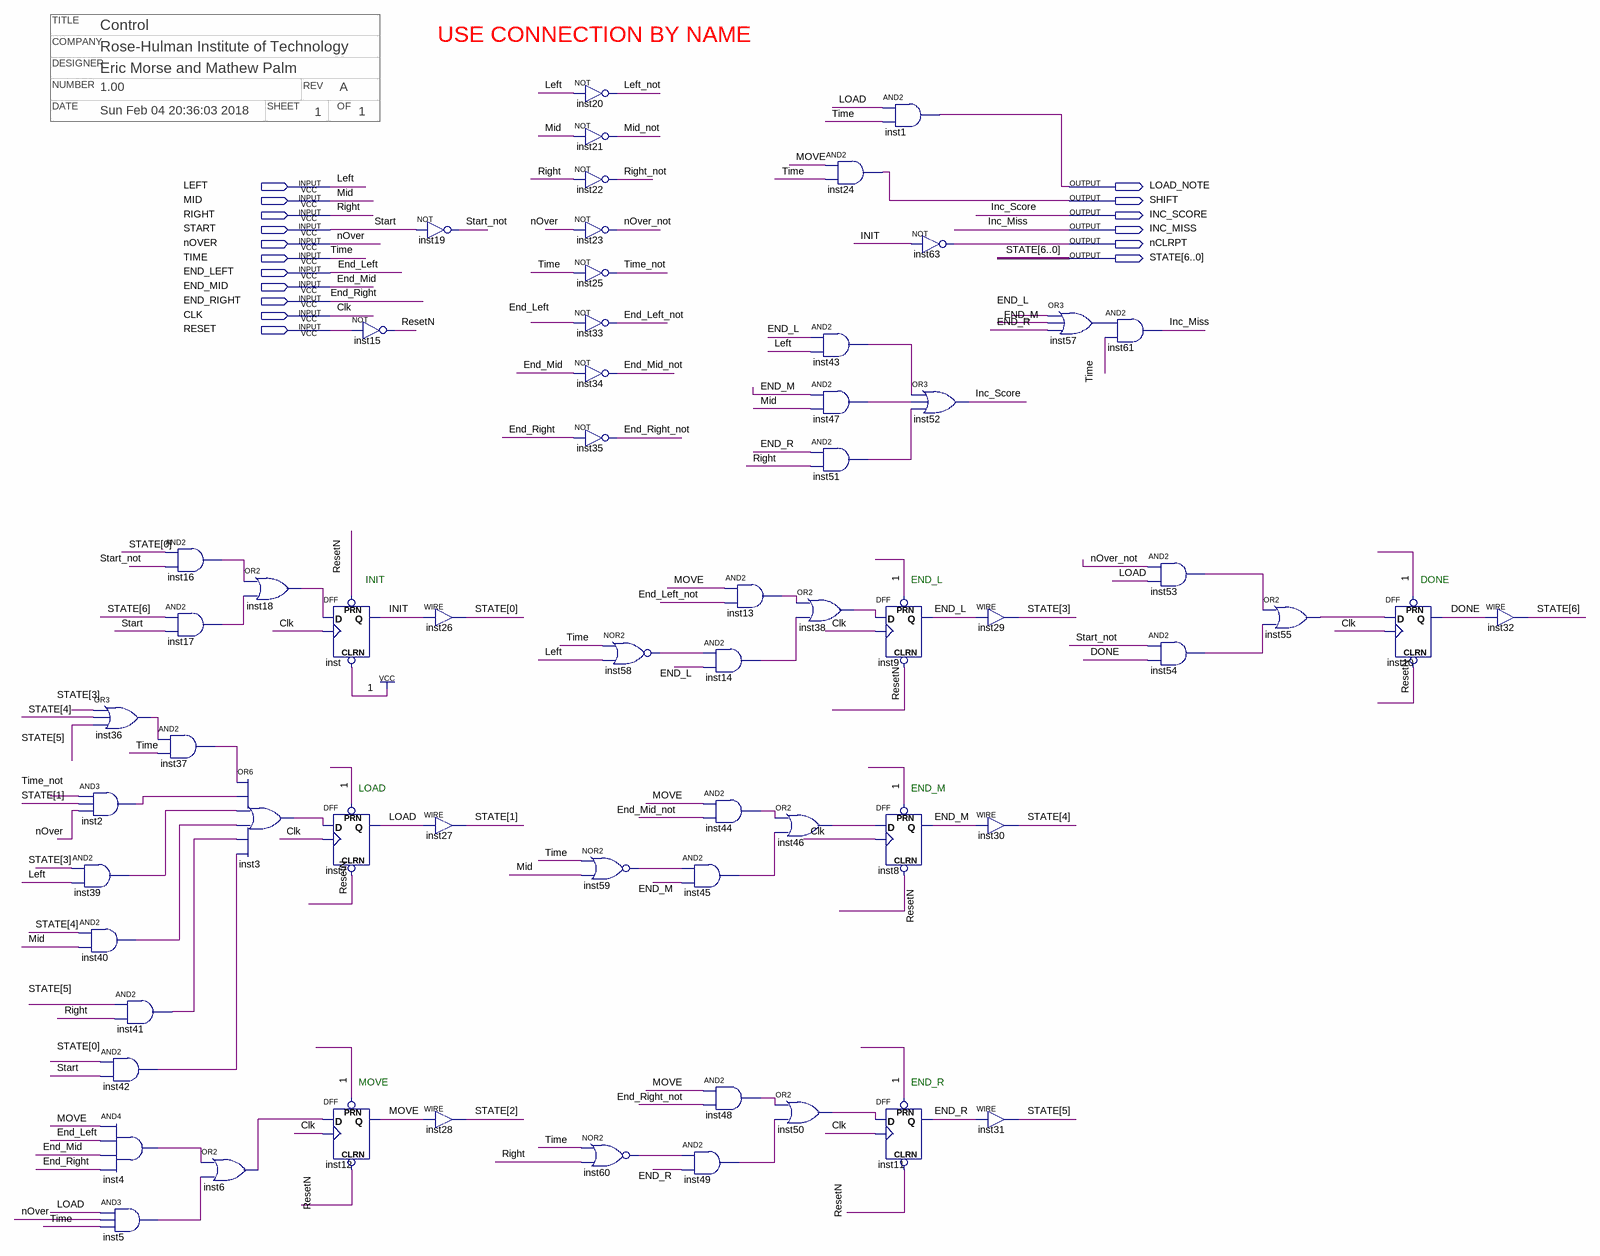
[diagram p0: schematic sheet]
// Quartus schematic control.bdf as structural Verilog: 62 symbols, 17 pins
// Title block: COMPANY: Rose-Hulman Institute of Technology; DATE: Sun Feb 04 20:36:03 2018; DESIGNER: Eric Morse and Mathew Palm; NUMBER: 1.00; OF: 1; REV: A; SHEET: 1; TITLE: Control
module control (
  input  LEFT,
  input  MID,
  input  RIGHT,
  input  START,
  input  nOVER,
  input  TIME,
  input  END_LEFT,
  input  END_MID,
  input  END_RIGHT,
  input  CLK,
  input  RESET,
  output LOAD_NOTE,
  output SHIFT,
  output INC_SCORE,
  output INC_MISS,
  output nCLRPT,
  output [6:0] STATE
);

  wire DONE, END_L, End_Left_not, END_M, End_Mid_not, END_R, End_Right_not, INIT, inst2_out, inst3_out,
       inst4_out, inst5_out, inst6_out, inst13_out, inst14_out, inst16_out, inst17_out, inst18_out,
       inst36_out, inst37_out, inst38_out, inst39_out, inst40_out, inst41_out, inst42_out, inst43_out,
       inst44_out, inst45_out, inst46_out, inst47_out, inst48_out, inst49_out, inst50_out, inst51_out,
       inst53_out, inst54_out, inst55_out, inst57_out, inst58_out, inst59_out, inst60_out, Left_not, LOAD,
       Mid_not, MOVE, nOver_not, ResetN, Right_not, Start_not, Time_not;

  or inst36 (inst36_out, STATE[3], STATE[4], STATE[5]);
  and inst2 (inst2_out, Time_not, STATE[1], nOVER);
  and inst39 (inst39_out, STATE[3], LEFT);
  and inst40 (inst40_out, STATE[4], MID);
  and inst41 (inst41_out, STATE[5], RIGHT);
  and inst42 (inst42_out, STATE[0], START);
  and inst4 (inst4_out, MOVE, END_LEFT, END_MID, END_RIGHT);
  and inst5 (inst5_out, LOAD, nOVER, TIME);
  and inst16 (inst16_out, STATE[0], Start_not);
  and inst17 (inst17_out, STATE[6], START);
  and inst37 (inst37_out, inst36_out, TIME);
  or inst3 (inst3_out, inst37_out, inst2_out, inst39_out, inst40_out, inst41_out, inst42_out);
  or inst6 (inst6_out, inst4_out, inst5_out);
  or inst18 (inst18_out, inst16_out, inst17_out);
  not inst15 (ResetN, RESET);
  DFF inst (.CLRN(1'b1), .CLK(CLK), .D(inst18_out), .PRN(ResetN), .Q(INIT));
  DFF inst7 (.CLRN(ResetN), .CLK(CLK), .D(inst3_out), .PRN(1'b1), .Q(LOAD));
  DFF inst12 (.CLRN(ResetN), .CLK(CLK), .D(inst6_out), .PRN(1'b1), .Q(MOVE));
  not inst19 (Start_not, START);
  assign STATE[0] = INIT;  // WIRE inst26
  assign STATE[1] = LOAD;  // WIRE inst27
  assign STATE[2] = MOVE;  // WIRE inst28
  not inst20 (Left_not, LEFT);
  not inst21 (Mid_not, MID);
  not inst22 (Right_not, RIGHT);
  not inst23 (nOver_not, nOVER);
  not inst25 (Time_not, TIME);
  not inst33 (End_Left_not, END_LEFT);
  not inst34 (End_Mid_not, END_MID);
  not inst35 (End_Right_not, END_RIGHT);
  nor inst59 (inst59_out, TIME, MID);
  nor inst60 (inst60_out, TIME, RIGHT);
  nor inst58 (inst58_out, TIME, LEFT);
  and inst45 (inst45_out, inst59_out, END_M);
  and inst49 (inst49_out, inst60_out, END_R);
  and inst13 (inst13_out, MOVE, End_Left_not);
  and inst14 (inst14_out, inst58_out, END_L);
  and inst44 (inst44_out, MOVE, End_Mid_not);
  and inst48 (inst48_out, MOVE, End_Right_not);
  and inst43 (inst43_out, END_L, LEFT);
  and inst47 (inst47_out, END_M, MID);
  and inst51 (inst51_out, END_R, RIGHT);
  or inst38 (inst38_out, inst13_out, inst14_out);
  or inst46 (inst46_out, inst44_out, inst45_out);
  or inst50 (inst50_out, inst48_out, inst49_out);
  and inst24 (SHIFT, MOVE, TIME);
  and inst1 (LOAD_NOTE, LOAD, TIME);
  not inst63 (nCLRPT, INIT);
  or inst52 (INC_SCORE, inst43_out, inst47_out, inst51_out);
  DFF inst9 (.CLRN(ResetN), .CLK(CLK), .D(inst38_out), .PRN(1'b1), .Q(END_L));
  DFF inst8 (.CLRN(ResetN), .CLK(CLK), .D(inst46_out), .PRN(1'b1), .Q(END_M));
  DFF inst11 (.CLRN(ResetN), .CLK(CLK), .D(inst50_out), .PRN(1'b1), .Q(END_R));
  assign STATE[3] = END_L;  // WIRE inst29
  assign STATE[4] = END_M;  // WIRE inst30
  assign STATE[5] = END_R;  // WIRE inst31
  or inst57 (inst57_out, END_L, END_M, END_R);
  and inst61 (INC_MISS, inst57_out, TIME);
  and inst53 (inst53_out, nOver_not, LOAD);
  and inst54 (inst54_out, Start_not, DONE);
  or inst55 (inst55_out, inst53_out, inst54_out);
  DFF inst10 (.CLRN(ResetN), .CLK(CLK), .D(inst55_out), .PRN(1'b1), .Q(DONE));
  assign STATE[6] = DONE;  // WIRE inst32

  // Notes on the sheet:
  //   USE CONNECTION BY NAME
  //   INIT
  //   END_L
  //   DONE
  //   LOAD
  //   END_M
  //   MOVE
  //   END_R
endmodule
